# Altium schematic sheet SIM800C.SchDoc: SIM800C GSM/GPRS Module
size 241 x 171 mm; Date: 10/31/2024; Author: Yasir Shahzad; DrawnBy: Yasir Shahzad; Organization: Mastermind Electronics; Revision: 1.0; SheetNumber: 1; SheetTotal: 1
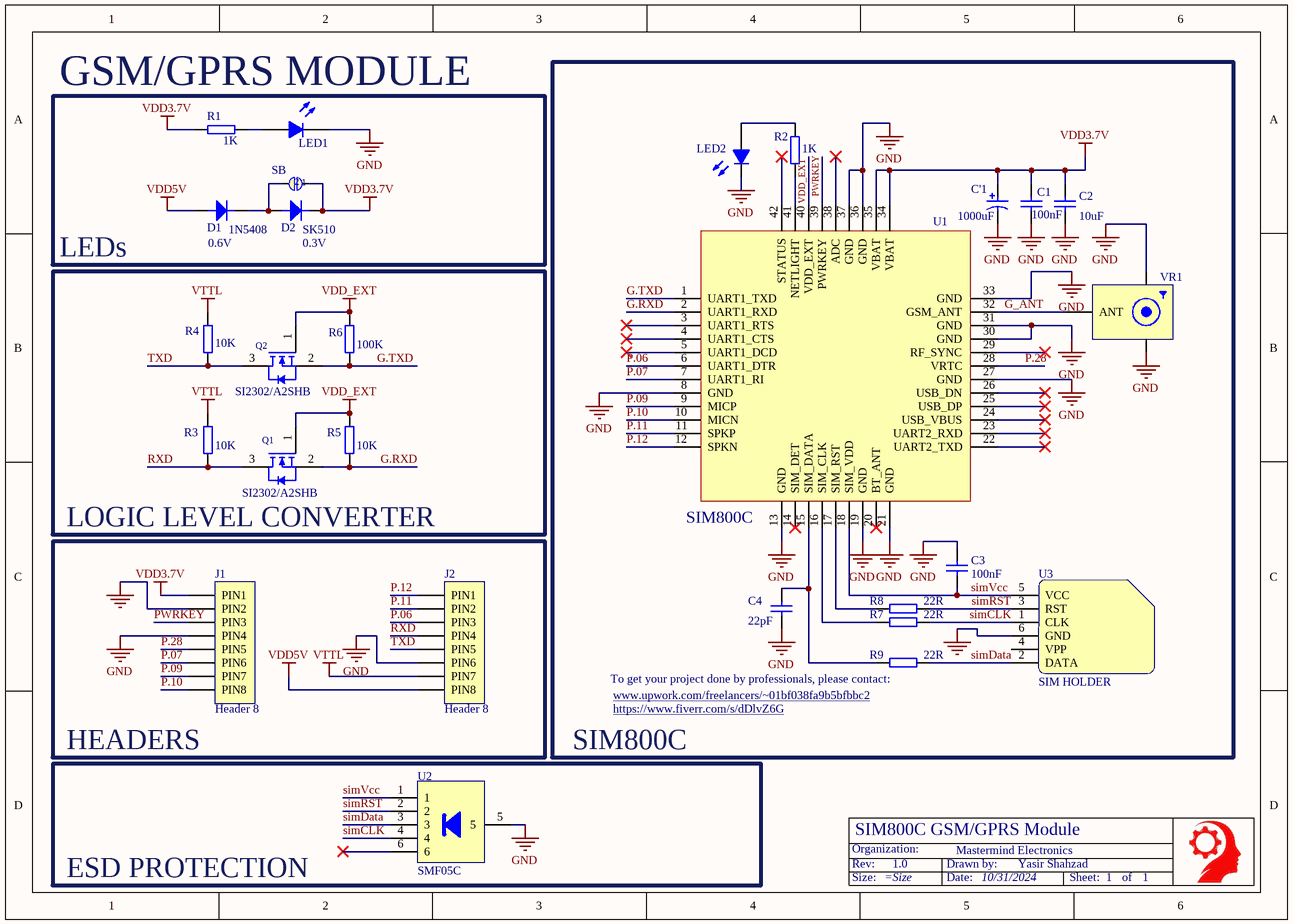
[diagram p0: SIM800C.SchDoc]

## Parts
*  TitleBlock  (value not drawn)  (graphical)
C1  10%  [0603C]  (value not drawn)
C2  10%  [0603C]  (value not drawn)
C3  10%  [0603C]  (value not drawn)
C4  10%  [0603C]  (value not drawn)
C'1  1000uF  [D]  (value not drawn)
D1  DIODE-DO214-AC  [SOD123]  (value not drawn)
D2  DIODE-DO214-AC  [SOD123]  (value not drawn)
J1  Header 8  [HDR1X8]
J2  Header 8  [HDR1X8]
LED1  LED  [0603LED]  (value not drawn)
LED2  LED  [0603LED]  (value not drawn)
Q1  A2SHB  [SOT23]  (value not drawn)
Q2  A2SHB  [SOT23]  (value not drawn)
R1  5%  [0603]  (value not drawn)
R2  5%  [0603]  (value not drawn)
R3  5%  [0603]  (value not drawn)
R4  5%  [0603]  (value not drawn)
R5  5%  [0603]  (value not drawn)
R6  5%  [0603]  (value not drawn)
R7  5%  [0603]  (value not drawn)
R8  5%  [0603]  (value not drawn)
R9  5%  [0603]  (value not drawn)
SB  SB  [Jumper-NO]  (value not drawn)
U1  DeviceName: SIM800C  [SMD]  (hidden comment: SIM800C GSM/GPRS Module)
U2  SOT363  [SOT363]  (value not drawn)
U3  SIM_LOCK  [SMD-6]  (value not drawn)
VR1  SMA Connector   90Â° DIP SMA Connector, 50 Ohm (4UConnector: 07259)  [SMD-3]  (value not drawn)

## Blocks framed on the sheet
SIM800C: C1-C4 C'1 LED2 R2 R7-R9 U1 U3 VR1
GSM/GPRS MODULE: D1 D2 LED1 R1 SB

## Nets
GND: C1.2 C2.2 C3.1 C4.2 C'1.2 J1.2(PIN2) J1.4(PIN4) J2.6(PIN6) LED1.2(K) LED2.2(K) U1.8(GND) U1.13(GND) U1.19(GND) U1.21(GND) U1.27(GND) U1.30(GND) U1.31(GND) U1.33(GND) U1.36(GND) U1.37(GND) U2.5 U3.6(GND) VR1.1(GND3) VR1.2(GND1)
VDD3.7V: C1.1 C2.1 C'1.1 D2.2(C) J1.1(PIN1) R1.1 SB.1 U1.34(VBAT) U1.35(VBAT)
VDD5V: D1.1(A) J2.8(PIN8)
VDD_EXT: Q1.1 Q2.1 R5.2 R6.2 U1.40(VDD_EXT)
VTTL: J2.7(PIN7) R3.1 R4.2
G.RXD: Q1.2 R5.1 U1.2(UART1_RXD)
G.TXD: Q2.2 R6.1 U1.1(UART1_TXD)
G_ANT: U1.32(GSM_ANT) VR1.3(ANT)
P.06: J2.3(PIN3) U1.6(UART1_DTR)
P.07: J1.6(PIN6) U1.7(UART1_RI)
P.09: J1.7(PIN7) U1.9(MICP)
P.10: J1.8(PIN8) U1.10(MICN)
P.11: J2.2(PIN2) U1.11(SPKP)
P.12: J2.1(PIN1) U1.12(SPKN)
P.28: J1.5(PIN5) U1.28(VRTC)
PWRKEY: J1.3(PIN3) U1.39(PWRKEY)
RXD: J2.4(PIN4) Q1.3 R3.2
simCLK: R7.1 U2.4 U3.1(CLK)
simData: R9.1 U2.3 U3.2(DATA)
simRST: R8.1 U2.2 U3.3(RST)
simVcc: C3.2 U1.18(SIM_VDD) U2.1 U3.5(VCC)
TXD: J2.5(PIN5) Q2.3 R4.1
NetC4_1: C4.1 R9.2 U1.15(SIM_DATA)
NetD1_2: D1.2(C) D2.1(A) SB.2
NetLED1_1: LED1.1(A) R1.2
NetLED2_1: LED2.1(A) R2.2
NetR2_1: R2.1 U1.41(NETLIGHT)
NetR7_2: R7.2 U1.16(SIM_CLK)
NetR8_2: R8.2 U1.17(SIM_RST)

Not connected (* = marked no-connect by the designer): U1 3(UART1_RTS)* 4(UART1_CTS)* 5(UART1_DCD)* 14(SIM_DET)* 20(BT_ANT)* 22(UART2_TXD)* 23(UART2_RXD)* 24(USB_VBUS)* 25(USB_DP)* 26(USB_DN)* 29(RF_SYNC)* 38(ADC)* 42(STATUS)*; U2 6*; U3 4(VPP)

## Notes on the sheet
- (near R1) 1K
- (near R2) 1K
- LEDs
- (near D1) 0.6V
- 1N5408
- (near D2) SK510
- (near D2) 0.3V
- 1000uF
- 100nF
- (near C2) 10uF
- (near R4) 10K
- (near Q2) SI2302/A2SHB
- (near R6) 100K
- (near R3) 10K
- (near R5) 10K
- LOGIC LEVEL CONVERTER
- (near Q1) SI2302/A2SHB
- (near R8) 22R
- (near C3) 100nF
- (near C4) 22pF
- (near R9) 22R
- 22R
- (near R9) To get your project done by professionals, please contact:
- (near R9) www.upwork.com/freelancers/~01bf038fa9b5bfbbc2 <http://www.upwork.com/freelancers/~01bf038fa9b5bfbbc2>
- https://www.fiverr.com/s/dDlvZ6G
- (near U3) SIM HOLDER
- HEADERS
- (near U2) SMF05C
- ESD PROTECTION
- (in symbol TitleBlock) Organization:; Rev:; Drawn by:; Size:; Date:; Sheet:; of

## Library data of the parts
* = TitleBlock: Title Block for Schematic Sheets
C1-C4 = CAP0603_NPOL: Chip capacitor
C'1 = Taltium
J1 J2 = Header 8: Header, 8-Pin; LatestRevisionDate: 17-Jul-2002; LatestRevisionNote: Re-released for DXP Platform.; Publisher: Altium Limited
LED1 LED2 = LEDCHIP-LED0603: SMD lamp beads
Q1 Q2 = BSS138: N Channel Mosfet
R1-R9 = RESISTOR: Chip Resistor; AEMS Code: 1200430
SB = SB: RESISTOR, American symbol
U1 = GSM_SIM800C: GateName_1: G$1; SymbolName_1: SIM900_LITERAL; DeviceSetName: GSM_SIM900_LITERAL; LibraryName: microbuilder; Package: SIM900_SMT; Parameter 1: *
U2 = SMF05C: GateName_1: G$1; SymbolName_1: TVSARRAY_5LANE; LibraryName: microbuilder; DeviceSetName: TVSARRAY_5LANE; Package: SOT363
U3 = SIM_LOCK: GateName_1: G$1; SymbolName_1: SIMLOCK-6; LibraryName: microbuilder; DeviceSetName: SIM_LOCK; Package: SIM_5002
VR1 = PatchAntenna